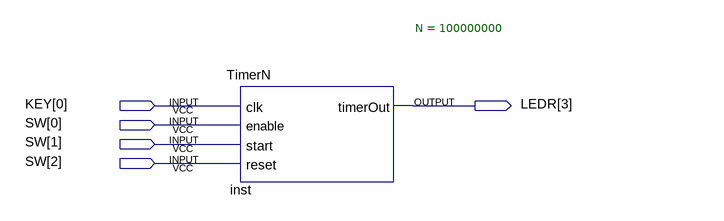
[diagram p0: schematic sheet]
// Quartus schematic TimerN_Demo.bdf as structural Verilog: 1 symbols, 5 pins
module TimerN_Demo (
  input  [0:0] KEY,
  input  [2:0] SW,
  output [3:3] LEDR
);

  TimerN #(.N(100000000)) inst (.clk(KEY[0]), .enable(SW[0]), .start(SW[1]), .reset(SW[2]), .timerOut(LEDR[3]));
endmodule
